# Altium schematic sheet Sensor.SchDoc
size A4
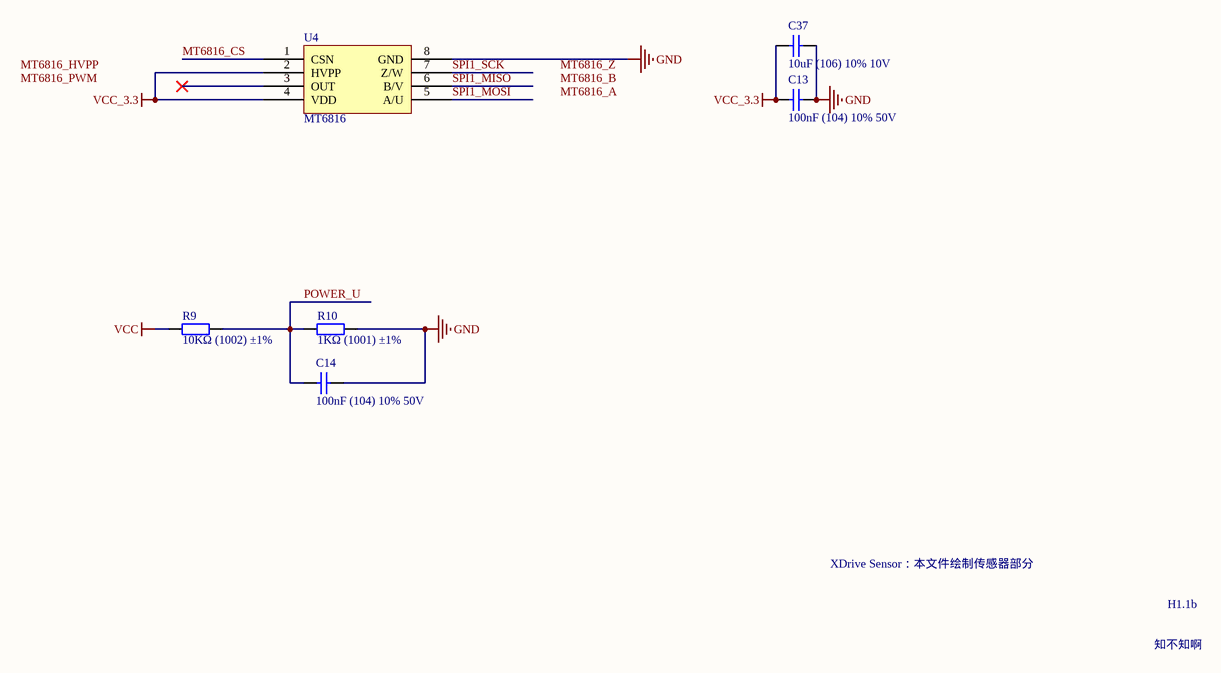
[diagram p0: Sensor.SchDoc]

## Parts
C13  100nF (104) 10% 50V  [0603_C]
C14  100nF (104) 10% 50V  [0603_C]
C37  10uF (106) 10% 10V  [0603_C]
R9  10KΩ (1002) ±1%  [0603_R]
R10  1KΩ (1001) ±1%  [0603_R]
U4  MT6816  [SOIC_8]

## Nets
GND: C13.1 C14.2 C37.1 R10.2 U4.8(GND)
VCC: R9.1
VCC_3.3: C13.2 C37.2 U4.2(HVPP) U4.4(VDD)
MT6816_CS: U4.1(CSN)
POWER_U: C14.1 R9.2 R10.1
SPI1_MISO: U4.6(B/V)
SPI1_MOSI: U4.5(A/U)
SPI1_SCK: U4.7(Z/W)

Not connected (* = marked no-connect by the designer): U4 3(OUT)*

## Notes on the sheet
- XDrive Sensor：本文件绘制传感器部分
- H1.1b
- 知不知啊
- Labels drawn without touching a wire or pin: MT6816_A, MT6816_B, MT6816_HVPP, MT6816_PWM, MT6816_Z

## Library data of the parts
C13 C14 = 0603 100nF (104) 10% 50V: 贴片电容; ComponentLink1Description: 供应商链接; ComponentLink1URL: http://www.szlcsc.com/product/details_15331.html; Package: 0603; Supplier: LC; SuppliersPartNumber: C14663
C37 = 0603 10uF (106) 10% 10V: 贴片电容; ComponentLink1Description: 供应商链接; ComponentLink1URL: http://www.szlcsc.com/product/details_20411.html; Package: 0603; Supplier: LC; SuppliersPartNumber: C19702
R9 = 0603 10KΩ (1002) 1%: 贴片电阻; ComponentLink1Description: 供应商链接; ComponentLink1URL: http://www.szlcsc.com/product/details_26547.html; Package: 0603; Supplier: LC; SuppliersPartNumber: C25804
R10 = 0603 1KΩ (1001) 1%: 贴片电阻; ComponentLink1Description: 供应商链接; ComponentLink1URL: http://www.szlcsc.com/product/details_21904.html; Package: 0603; Supplier: LC; SuppliersPartNumber: C21190
U4 = MT6816: 磁角度传感器